# EAGLE design NeoDigito Medio (EAGLE 9.1.3)
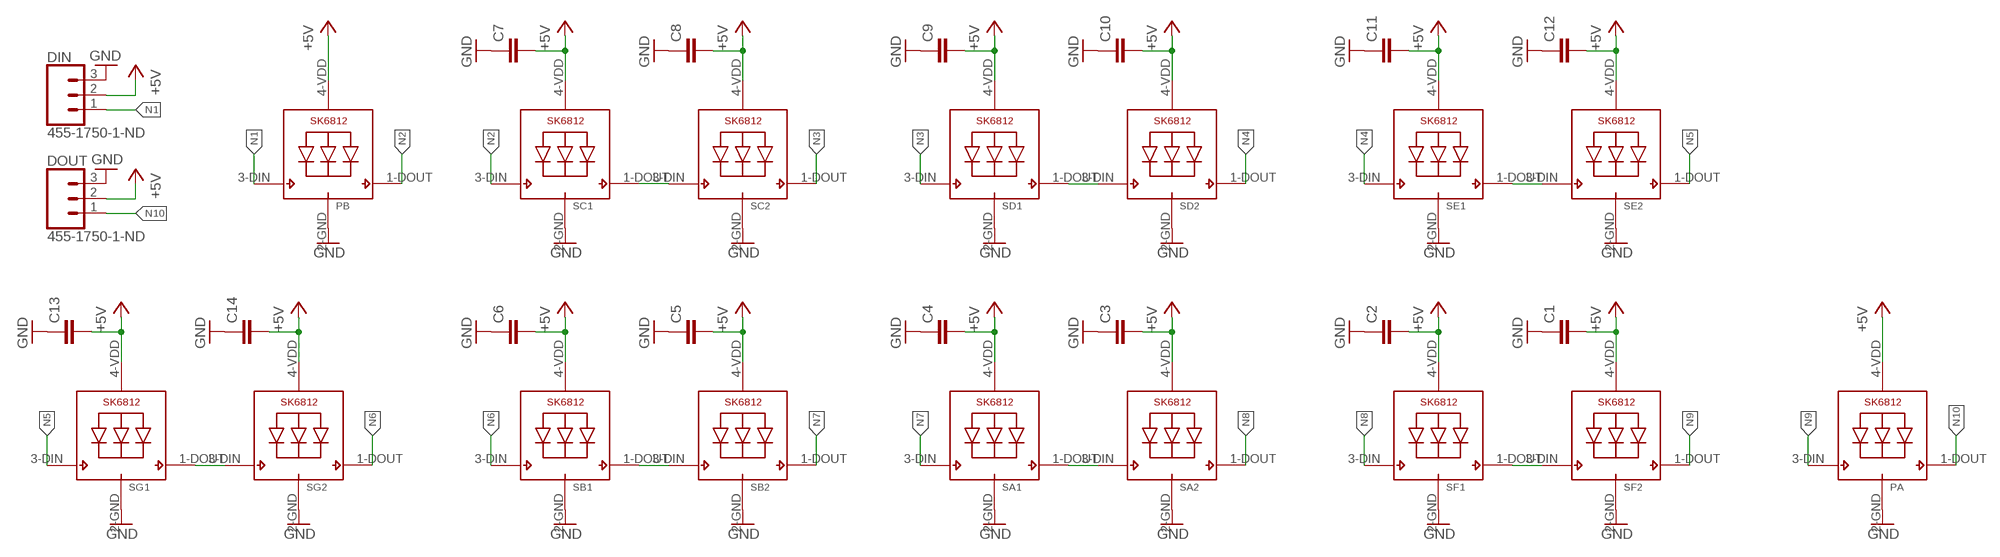
[diagram p0: schematic, sheet 1]

## Parts
C1  C-EUC0805  [C0805]
C2  C-EUC0805  [C0805]
C3  C-EUC0805  [C0805]
C4  C-EUC0805  [C0805]
C5  C-EUC0805  [C0805]
C6  C-EUC0805  [C0805]
C7  C-EUC0805  [C0805]
C8  C-EUC0805  [C0805]
C9  C-EUC0805  [C0805]
C10  C-EUC0805  [C0805]
C11  C-EUC0805  [C0805]
C12  C-EUC0805  [C0805]
C13  C-EUC0805  [C0805]
C14  C-EUC0805  [C0805]
DIN  455-1750-1-ND  CONN_03  [1X03]
DOUT  455-1750-1-ND  CONN_031X03_NO_SILK  [1X03_NO_SILK]
PA  SK6812_3535  [LED3535]
PB  SK6812_3535  [LED3535]
SA1  SK6812_3535  [LED3535]
SA2  SK6812_3535  [LED3535]
SB1  SK6812_3535  [LED3535]
SB2  SK6812_3535  [LED3535]
SC1  SK6812_3535  [LED3535]
SC2  SK6812_3535  [LED3535]
SD1  SK6812_3535  [LED3535]
SD2  SK6812_3535  [LED3535]
SE1  SK6812_3535  [LED3535]
SE2  SK6812_3535  [LED3535]
SF1  SK6812_3535  [LED3535]
SF2  SK6812_3535  [LED3535]
SG1  SK6812_3535  [LED3535]
SG2  SK6812_3535  [LED3535]

## Nets
+5V: C1.2 C2.2 C3.2 C4.2 C5.2 C6.2 C7.2 C8.2 C9.2 C10.2 C11.2 C12.2 C13.2 C14.2 DIN.2 DOUT.2 PA.4-VDD(VDD) PB.4-VDD(VDD) SA1.4-VDD(VDD) SA2.4-VDD(VDD) SB1.4-VDD(VDD) SB2.4-VDD(VDD) SC1.4-VDD(VDD) SC2.4-VDD(VDD) SD1.4-VDD(VDD) SD2.4-VDD(VDD) SE1.4-VDD(VDD) SE2.4-VDD(VDD) SF1.4-VDD(VDD) SF2.4-VDD(VDD) SG1.4-VDD(VDD) SG2.4-VDD(VDD)
GND: C1.1 C2.1 C3.1 C4.1 C5.1 C6.1 C7.1 C8.1 C9.1 C10.1 C11.1 C12.1 C13.1 C14.1 DIN.3 DOUT.3 PA.2-GND(GND) PB.2-GND(GND) SA1.2-GND(GND) SA2.2-GND(GND) SB1.2-GND(GND) SB2.2-GND(GND) SC1.2-GND(GND) SC2.2-GND(GND) SD1.2-GND(GND) SD2.2-GND(GND) SE1.2-GND(GND) SE2.2-GND(GND) SF1.2-GND(GND) SF2.2-GND(GND) SG1.2-GND(GND) SG2.2-GND(GND)
N1: DIN.1 PB.3-DIN(DI)
N2: PB.1-DOUT(DO) SC1.3-DIN(DI)
N3: SC2.1-DOUT(DO) SD1.3-DIN(DI)
N4: SD2.1-DOUT(DO) SE1.3-DIN(DI)
N5: SE2.1-DOUT(DO) SG1.3-DIN(DI)
N6: SB1.3-DIN(DI) SG2.1-DOUT(DO)
N7: SA1.3-DIN(DI) SB2.1-DOUT(DO)
N8: SA2.1-DOUT(DO) SF1.3-DIN(DI)
N9: PA.3-DIN(DI) SF2.1-DOUT(DO)
N10: DOUT.1 PA.1-DOUT(DO)
N$1: SE1.1-DOUT(DO) SE2.3-DIN(DI)
N$2: SC1.1-DOUT(DO) SC2.3-DIN(DI)
N$3: SA1.1-DOUT(DO) SA2.3-DIN(DI)
N$4: SF1.1-DOUT(DO) SF2.3-DIN(DI)
N$5: SD1.1-DOUT(DO) SD2.3-DIN(DI)
N$14: SG1.1-DOUT(DO) SG2.3-DIN(DI)
N$17: SB1.1-DOUT(DO) SB2.3-DIN(DI)

## Library data of the parts
C1-C14 = CCV1:C-EU: CAPACITOR, European symbol; SPICEPREFIX: C
DIN = CCV1:CONN_03: Multi connection point. Often used as Generic Header-pin footprint for 0.1 inch spaced/style header connections On any of the 0.1 inch spaced packages, you can populate with these: Break Away Headers - Straight <https://www.sparkfun.com/products/116> (PRT-00116) Break Away Male Headers - Right Angle <https://www.sparkfun.com/products/553> (PRT-00553) Female Headers <https://www.sparkfun.com/products/115> (PRT-00115) Break Away Headers - Machine Pin <https://www.sparkfun.com/products/117> (PRT-00117) Break Away Female Headers - Swiss Machine Pin <https://www.sparkfun.com/products/743> (PRT-00743) Stackable Header - 3 Pin (Female, 0.1") <https://www.sparkfun.com/products/13875> (PRT-13875) For SCREWTERMINALS and SPRING TERMINALS visit here: Screw Terimnals on SparkFun.com <https://www.sparkfun.com/search/results?term=Screw+Terminals> (5mm/3.5mm/2.54mm spacing) This device is also useful as a general connection point to wire up your design to another part of your project. Our various solder wires solder well into these plated through hole pads. Hook-Up Wire - Assortment (Stranded, 22 AWG) <https://www.sparkfun.com/products/11375> (PRT-11375) Hook-Up Wire - Assortment (Solid Core, 22 AWG) <https://www.sparkfun.com/products/11367> (PRT-11367) View the entire wire category on our website here <https://www.sparkfun.com/categories/141> Special notes: Molex polarized connector foot print use with SKU : PRT-08232 with associated crimp pins and housings.; PROD_ID: XXX-00000
DOUT = CCV1:CONN_03: Multi connection point. Often used as Generic Header-pin footprint for 0.1 inch spaced/style header connections On any of the 0.1 inch spaced packages, you can populate with these: Break Away Headers - Straight <https://www.sparkfun.com/products/116> (PRT-00116) Break Away Male Headers - Right Angle <https://www.sparkfun.com/products/553> (PRT-00553) Female Headers <https://www.sparkfun.com/products/115> (PRT-00115) Break Away Headers - Machine Pin <https://www.sparkfun.com/products/117> (PRT-00117) Break Away Female Headers - Swiss Machine Pin <https://www.sparkfun.com/products/743> (PRT-00743) Stackable Header - 3 Pin (Female, 0.1") <https://www.sparkfun.com/products/13875> (PRT-13875) For SCREWTERMINALS and SPRING TERMINALS visit here: Screw Terimnals on SparkFun.com <https://www.sparkfun.com/search/results?term=Screw+Terminals> (5mm/3.5mm/2.54mm spacing) This device is also useful as a general connection point to wire up your design to another part of your project. Our various solder wires solder well into these plated through hole pads. Hook-Up Wire - Assortment (Stranded, 22 AWG) <https://www.sparkfun.com/products/11375> (PRT-11375) Hook-Up Wire - Assortment (Solid Core, 22 AWG) <https://www.sparkfun.com/products/11367> (PRT-11367) View the entire wire category on our website here <https://www.sparkfun.com/categories/141> Special notes: Molex polarized connector foot print use with SKU : PRT-08232 with associated crimp pins and housings.
PA PB SA1 SA2 SB1 SB2 SC1 SC2 SD1 SD2 SE1 SE2 SF1 SF2 SG1 SG2 = CCV1:SK6812

## Board
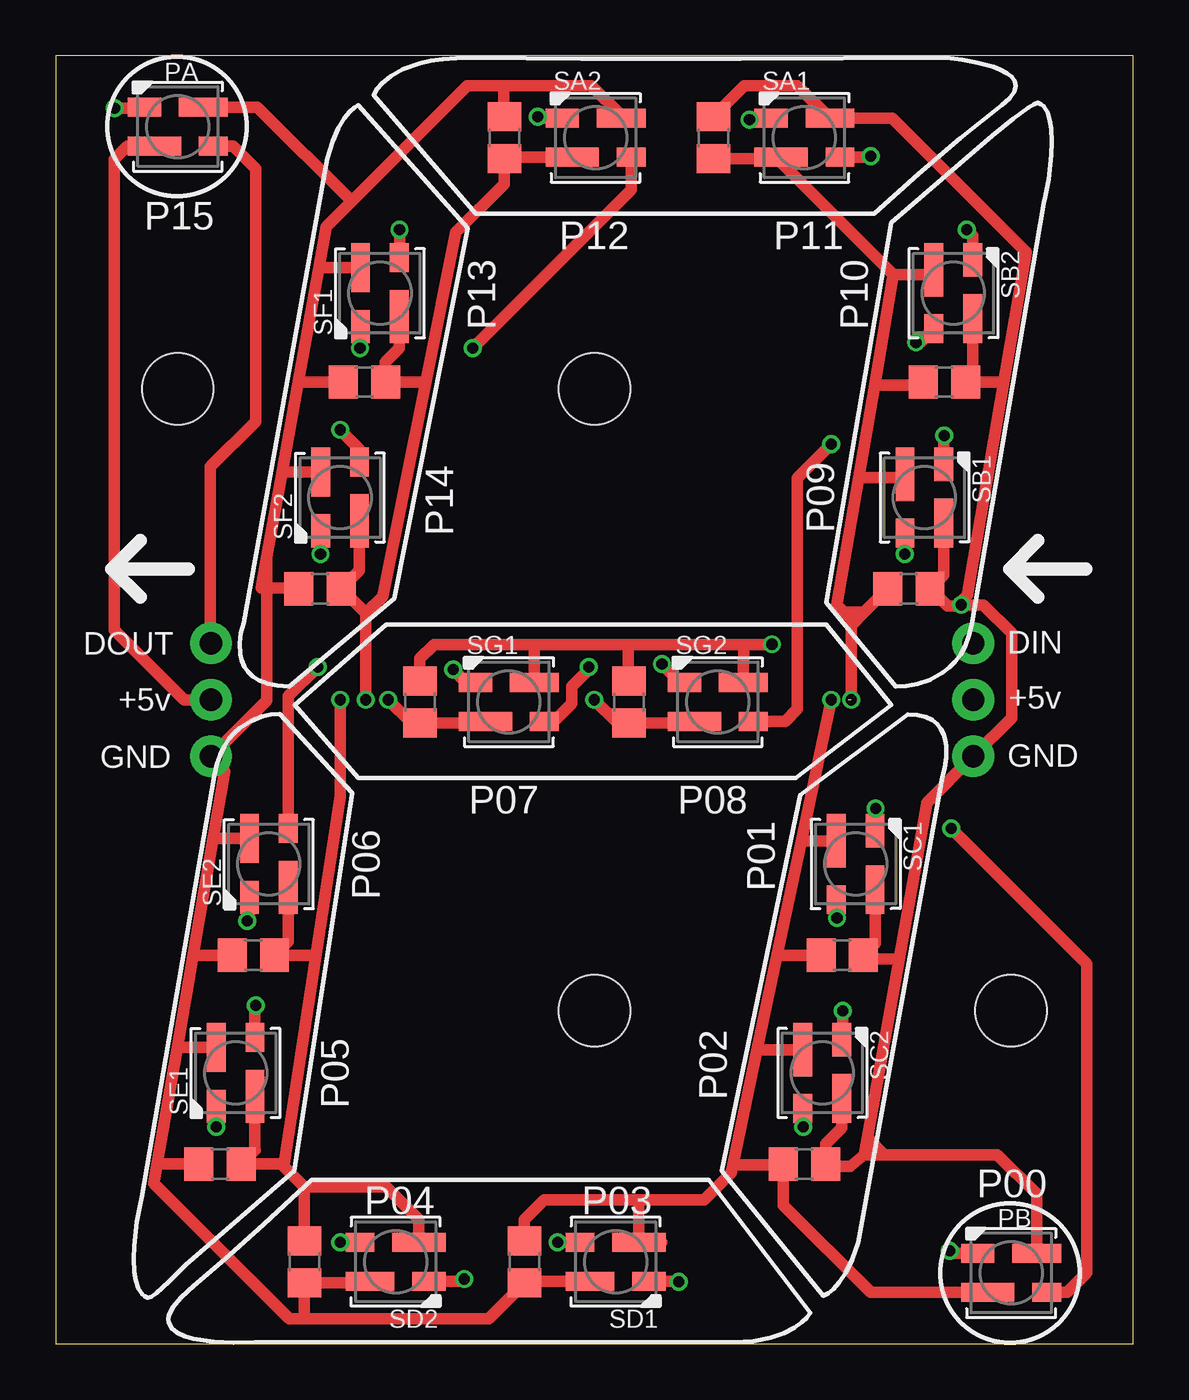
[diagram p1: board, top side]
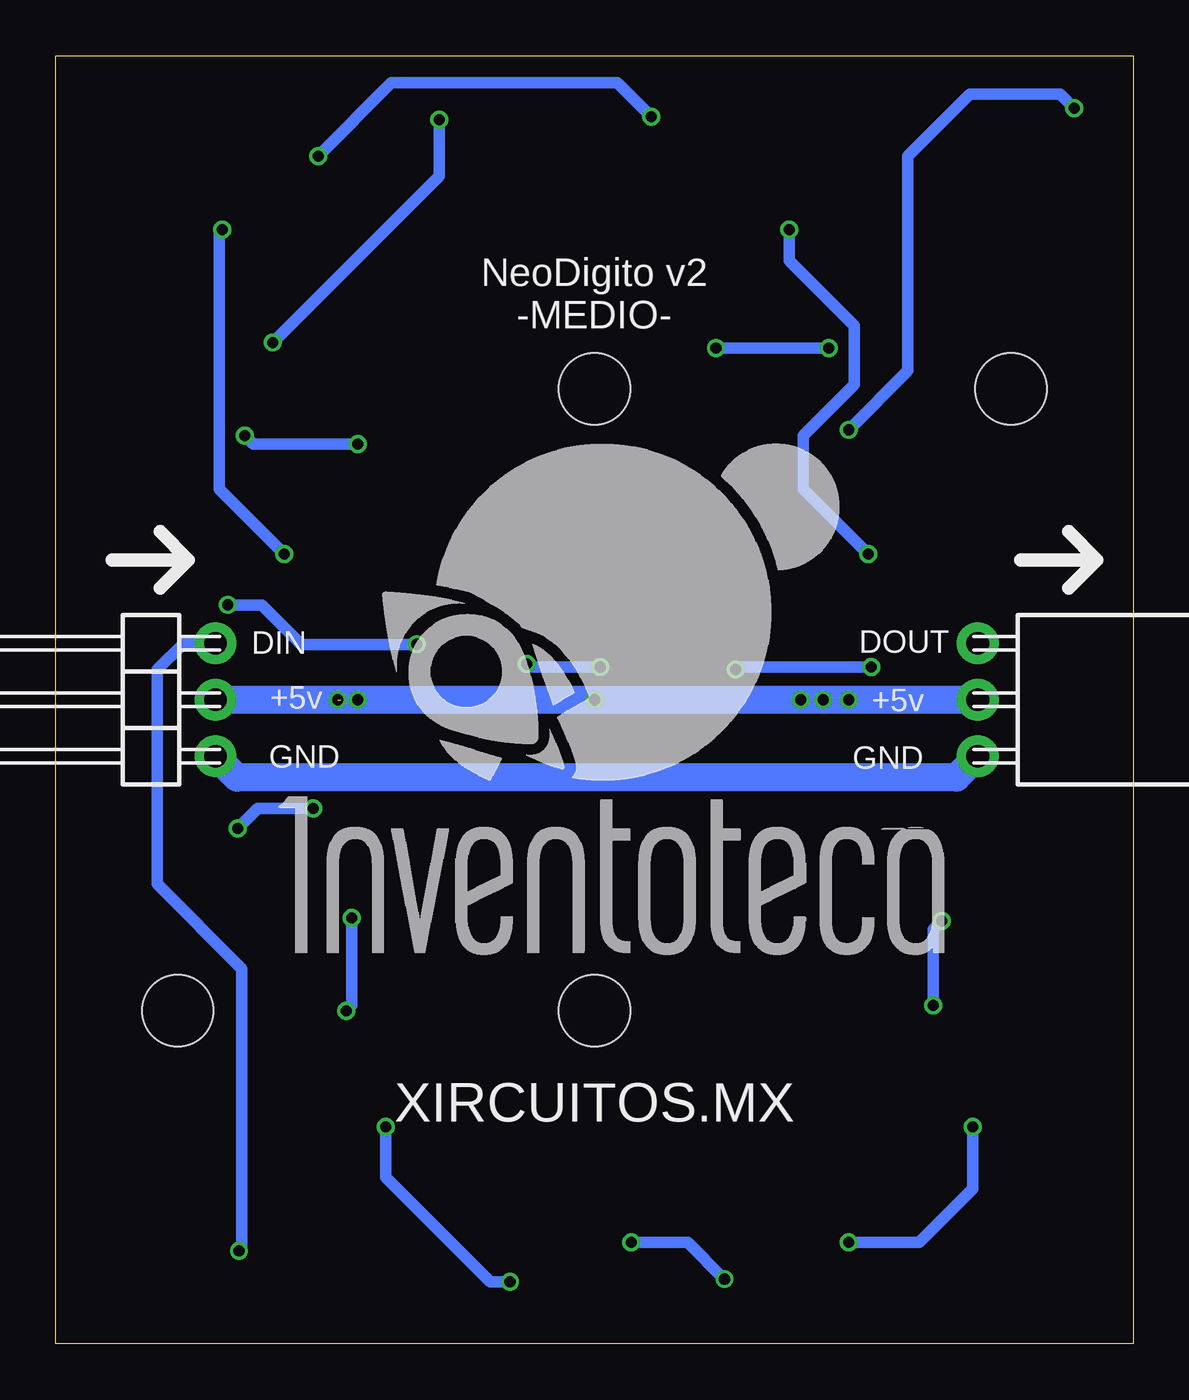
[diagram p2: board, bottom side, seen from below]

Size 48.5 x 58 mm. Coordinates in mm from the lower left corner, seen from the top.
Outline: 0,0 48.5,0 48.5,58 0,58 0,0
Copper layers (1*16): Top 0.035mm / dielectric 1.5mm / Bottom 0.035mm
Design rules "_xircuitos.mx_2L_DRC": minimum track width 6mil, minimum drill 12mil, track to track 6mil, track to pad 6mil, pad to pad 6mil, via to via 6mil, smd to smd 0mil, copper to edge 10mil, drill to drill 12mil, minimum pad ring 10mil, minimum via ring 6mil, stop-mask expansion 2mil, vias tented up to drill 100mil, thermal gap 10mil
Holes 3.2 mm at 24.25,15 24.25,43 5.5,43 43,15

### Footprints (pad centres in the part's own frame; a part is rotated, then mirrored left to right if it is on the bottom)
C0805 = smd 1.3 x 1.5: 1 -0.95,0; 2 0.95,0
1X03 = drill 1 pad 1.88: 1 -2.54,0; 2 0,0; 3 2.54,0
1X03_NO_SILK = drill 1.016 pad 1.88: 1 -2.54,0; 2 0,0; 3 2.54,0
LED3535 = smd 1.3 x 0.85: 1-DOUT 1.6,-0.875 | smd 2.2 x 0.85: 2-GND 1.15,0.875 | smd 1.5 x 0.85: 3-DIN -1.5,0.875 | smd 2.4 x 0.85: 4-VDD -1.05,-0.875

### Placement (x,y rotation side)
C1  11.9,34 0 top
C2  13.9,43.3 0 top
C3  20.2,54.3 270 top
C4  29.6,54.3 270 top
C5  40,43.3 180 top
C6  38.4,34 180 top
C7  35.4,17.5 180 top
C8  33.7,8.1 180 top
C9  21.1,3.7 90 top
C10  11.2,3.7 90 top
C11  7.4,8.1 0 top
C12  8.9,17.5 0 top
C13  16.4,28.9 270 top
C14  25.8,28.9 270 top
DIN  41.3,29 270 bottom
DOUT  7,29 270 bottom
PA  5.5,54.8 0 top
PB  43,3.2 0 top
SA1  33.7,54.3 0 top
SA2  24.3,54.3 0 top
SB1  39.1,38.1 270 top
SB2  40.4,47.3 270 top
SC1  36,21.6 270 top
SC2  34.5,12.2 270 top
SD1  25.2,3.7 180 top
SD2  15.3,3.7 180 top
SE1  8.1,12.2 90 top
SE2  9.6,21.6 90 top
SF1  14.6,47.3 90 top
SF2  12.8,38.1 90 top
SG1  20.4,28.9 0 top
SG2  29.8,28.9 0 top

### Tracks (layer width: path | path; a pad name or v marks a point on that pad's centre or on a via)
+5V  (via drill 0.5)  (1 unrouted)
  Top 0.508: PB.4-VDD 36.67,2.33 32.75,6.25 C8.2 32.71,8.06 30.48,8.06 30.52,8.1 30.52,8.25 | 27.27,4.58 SD1.4-VDD 26.25,6.35 26.4,6.5 | 30.52,8.25 30.4,7.7 29.2,6.5 26.4,6.5 | 30.52,8.25 31.58,13.3 | 31.58,13.3 32.48,17.57 | 32.48,17.57 33.55,22.59 | 33.55,22.59 v34.9,29 | SC1.4-VDD 33.61,22.65 33.55,22.59 | C7.2 32.55,17.5 32.48,17.57 | SC2.4-VDD 31.64,13.25 31.58,13.3 | C9.2 21.1,5.6 22,6.5 26.4,6.5 | SE2.4-VDD 10.47,18.12 C12.2 11.66,17.5 11.73,17.57 | SE1.4-VDD 8.97,8.72 C11.2 10.17,8.1 10.27,8 | 11.73,17.57 12.81,24.64 12.81,24.68 v12.81,29 | 11.73,17.57 10.27,8 | 10.27,8 11.2,7.07 | 11.2,7.07 C10.2 | SD2.4-VDD 16.35,5.61 14.88,7.07 11.2,7.07 | SG1.4-VDD 19.27,27.95 C13.2 16.02,27.95 v14.97,29 | SG2.4-VDD 28.84,27.94 29.19,27.94 29.18,27.95 C14.2 25.29,27.95 v24.24,29 | v13.95,29 13.95,32.89 | 13.95,32.89 14.72,33.66 16.68,43.4 | 16.68,43.4 18.02,50.04 20.2,52.22 C3.2 20.27,53.42 SA2.4-VDD | C4.2 32.58,53.35 SA1.4-VDD 32.65,53.19 37.7,48.13 | v35.8,29 35.8,32 | 35.8,32 35.8,32.64 35.42,33.02 | 35.42,33.02 35.16,33.27 36.14,38.99 | 36.14,38.99 36.85,43.17 | 36.85,43.17 37.7,48.13 | SB2.4-VDD 39.31,48.13 37.7,48.13 | C5.2 38.92,43.17 36.85,43.17 | SB1.4-VDD 38.07,38.99 36.14,38.99 | C6.2 36.39,32.94 | 36.39,32.94 35.8,32.35 35.8,32 | 35.42,33.02 35.5,32.94 36.39,32.94 | 16.68,43.4 16.58,43.3 C2.2 14.84,44.2 15.47,44.83 SF1.4-VDD | 13.95,32.89 13.95,32.9 C1.2 13.68,34.83 SF2.4-VDD | PA.4-VDD 3.24,53.92 2.65,53.34 2.65,32.13 5.78,29 DOUT.2
  Bottom 0.508: 14.08,29 v13.95,29
  Bottom 1.27: DOUT.2 v12.81,29 v13.95,29 v14.97,29 v24.24,29 v34.9,29 v35.8,29 DIN.2 | 14.08,29 | 35.67,29
GND  (via drill 0.5)
  Top 0.508: PB.2-GND 44.15,6.75 42.38,8.52 37.3,8.52 | SC2.2-GND 35.38,9.72 34.65,9 C8.1 34.75,8 35.77,8 36.39,8.52 | SC1.2-GND 36.88,18.02 C7.1 36.51,17.34 37.96,17.34 | 37.96,17.34 39.2,24.3 39.2,24.36 DIN.3 43.02,28.18 43.02,32 41.75,33.27 v40.75,33.27 40.62,33.27 40.56,33.21 | 37.96,17.34 36.57,9.51 | 36.57,9.51 36.39,8.52 | 37.3,8.52 36.39,8.52 | 37.3,8.52 36.57,9.26 36.57,9.51 | SD1.2-GND 21.18,2.83 | 21.18,2.83 C9.1 | 7.09,22.8 7.6,25.78 DOUT.3 9.51,28.97 9.51,35.45 | 7.09,22.8 6.19,17.53 | 6.19,17.53 5.49,13.43 | 5.49,13.43 4.58,8.14 | 4.58,8.14 4.43,7.24 10.53,1.14 11.03,1.14 | 21.18,2.83 19.49,1.14 11.03,1.14 | 11.03,1.14 11.2,1.31 C10.1 14.07,2.75 SD2.2-GND | C11.1 4.63,8.1 4.58,8.14 | SE1.2-GND 5.57,13.35 5.49,13.43 | C12.1 6.22,17.5 6.19,17.53 | SE2.2-GND 7.14,22.75 7.09,22.8 | SG2.2-GND 30.95,30.84 30.97,30.86 30.97,31.37 30.84,31.5 | 21.57,31.5 17.03,31.5 16.4,30.87 C13.1 | 21.57,31.5 25.77,31.5 | 25.77,31.5 30.34,31.5 30.84,31.5 | C14.1 25.77,29.89 25.77,31.5 | SG1.2-GND 21.55,31.47 21.57,31.5 | 40.56,33.21 41.03,33.68 42.67,43.3 | 42.67,43.3 43.67,49.15 37.65,55.17 SA1.2-GND 33.38,56.64 30.99,56.64 C4.1 | 9.51,35.45 10.2,39.28 | 10.2,39.28 10.94,43.43 | 10.94,43.43 11.86,48.52 | 11.86,48.52 12.18,50.29 13.32,51.44 | 13.32,51.44 18.53,56.64 20.18,56.64 | 20.18,56.64 24.11,56.64 25.45,55.31 SA2.2-GND | C3.1 20.18,55.27 20.18,56.64 | PA.2-GND 9.08,55.67 13.32,51.44 | C1.1 10.91,34.04 9.26,34.04 9.51,35.45 | C2.1 11.07,43.3 10.94,43.43 | SF2.2-GND 10.23,39.25 10.2,39.28 | SF1.2-GND 11.93,48.45 11.86,48.52 | 40.56,33.21 40.14,33.21 C6.1 39.98,34.62 SB1.2-GND | SB2.2-GND 41.27,43.62 C5.1 42.67,43.3 | 30.84,31.5 v32.24,31.5
  Bottom 0.508: v32.24,31.5 37.45,31.5 39.23,33.27 v40.75,33.27
  Bottom 1.27: DOUT.3 7.96,25.5 40.34,25.5 DIN.3
N1  (via drill 0.5)
  Top 0.508: v40.24,4.19 40.36,4.08 PB.3-DIN
  Bottom 0.508: DIN.1 42.74,31.54 43.93,30.35 43.93,20.7 40.12,16.89 40.12,4.32 v40.24,4.19
N2  (via drill 0.5)
  Top 0.508: PB.1-DOUT 45.52,2.33 46.4,3.2 46.4,17.1 v40.3,23.2 | v36.9,24.1 36.9,23.12 SC1.3-DIN
  Bottom 0.508: v40.3,23.2 39.4,24.1 v36.9,24.1
N3  (via drill 0.5)
  Top 0.508: SC2.1-DOUT 33.62,9.79 v33.64,9.78 | v28.05,2.79 28.02,2.83 SD1.3-DIN
  Bottom 0.508: v33.64,9.78 33.64,7.49 28.94,2.79 v28.05,2.79
N4  (via drill 0.5)
  Top 0.508: SD2.1-DOUT v12.81,4.58 v12.81,4.57 | v7.22,9.78 SE1.3-DIN
  Bottom 0.508: v12.81,4.57 9.64,4.57 7.22,6.99 v7.22,9.78
N5  (via drill 0.5)
  Top 0.508: SE2.1-DOUT 10.47,29.16 v11.79,30.48 | v17.89,30.35 18.47,29.77 SG1.3-DIN
  Bottom 0.508: v11.79,30.48 17.76,30.48 v17.89,30.35
N6  (via drill 0.5)
  Top 0.508: SG2.1-DOUT 32.84,28.02 33.38,28.57 33.38,38.99 v34.91,40.51 | v39.99,40.89 39.98,40.88 SB1.3-DIN
  Bottom 0.508: v34.91,40.51 39.61,40.51 v39.99,40.89
N7  (via drill 0.5)
  Top 0.508: SB2.1-DOUT 38.91,45.09 v38.72,45.09 | v31.23,55.12 32.14,55.12 SA1.3-DIN
  Bottom 0.508: v38.72,45.09 31.23,52.58 v31.23,55.12
N8  (via drill 0.5)
  Top 0.508: SA2.1-DOUT 25.9,51.95 v18.78,44.83 | v13.7,44.83 13.72,44.86 SF1.3-DIN
  Bottom 0.508: v18.78,44.83 v13.7,44.83
N9  (via drill 0.5)
  Top 0.508: SF2.1-DOUT 13.68,40.28 v12.81,41.15 | v2.65,55.63 3.95,55.63 PA.3-DIN
  Bottom 0.508: v12.81,41.15 10.14,43.81 10.14,53.47 7.35,56.26 3.29,56.26 v2.65,55.63
N10
  Top 0.508: DOUT.1 6.97,31.57 6.97,39.5 9,41.53 9,52.91 7.99,53.92 PA.1-DOUT
N$1  (via drill 0.5)
  Top 0.508: SE1.1-DOUT 8.97,15.21 v9,15.24 | v8.62,19.05 8.72,19.16 SE2.3-DIN
  Bottom 0.508: v9,15.24 9,18.67 v8.62,19.05
N$2  (via drill 0.5)
  Top 0.508: SC1.1-DOUT 35.16,19.96 v35.16,19.18 | v35.42,14.99 35.42,13.74 SC2.3-DIN
  Bottom 0.508: v35.16,19.18 35.16,15.24 v35.42,14.99
N$3  (via drill 0.5)
  Top 0.508: SA1.1-DOUT 36.65,53.42 v36.69,53.47 | v21.7,55.24 21.77,55.17 SA2.3-DIN
  Bottom 0.508: v36.69,53.47 33.38,56.77 23.23,56.77 v21.7,55.24
N$4  (via drill 0.5)
  Top 0.508: SF1.1-DOUT v15.48,50.16 | v11.92,35.56 v11.93,35.56 SF2.3-DIN
  Bottom 0.508: v15.48,50.16 15.48,48.77 12.56,45.85 12.56,43.18 14.84,40.89 14.84,38.48 v11.92,35.56
N$5  (via drill 0.5)
  Top 0.508: SD2.3-DIN 18.3,2.83 v18.4,2.92 | v22.59,4.57 SD1.1-DOUT
  Bottom 0.508: v18.4,2.92 20.05,4.57 v22.59,4.57
N$14  (via drill 0.5)
  Top 0.508: SG1.1-DOUT 22.42,28.02 23.23,28.83 23.23,29.59 23.99,30.35 v23.99,30.48 | v27.29,30.61 28.12,29.77 SG2.3-DIN
  Bottom 0.508: v23.99,30.48 27.16,30.48 v27.29,30.61
N$17  (via drill 0.5)
  Top 0.508: SB1.1-DOUT 38.23,35.57 v38.21,35.56 | v41.01,50.16 41.27,49.9 SB2.3-DIN
  Bottom 0.508: v38.21,35.56 41.13,38.48 41.13,50.04 v41.01,50.16

### Text on the board
tPlace: P15 | P12 | P11 | P13 | P10 | P14 | P09 | DOUT | DIN | +5v | +5v | GND | GND | P07 | P08 | P06 | P01 | P02 | P05 | P00 | P04 | P03
bPlace: NeoDigito v2 / -MEDIO- | +5v | +5v | GND | GND | XIRCUITOS.MX